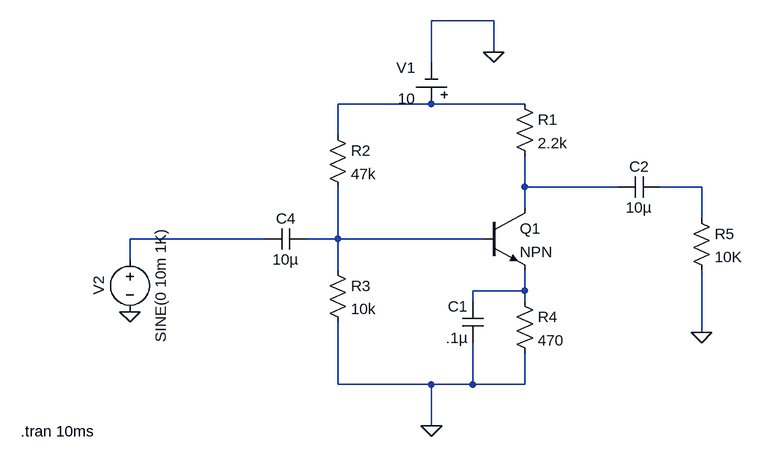
[diagram p0: schematic Amplifier Circuit.asc]
Amplifier Circuit.asc, the LTspice schematic file:
Version 4
SHEET 1 880 680
WIRE 192 -240 96 -240
WIRE 192 -192 192 -240
WIRE 96 -176 96 -240
WIRE 96 -112 -48 -112
WIRE 240 -112 96 -112
WIRE -48 -64 -48 -112
WIRE 240 16 240 -32
WIRE 384 16 240 16
WIRE 512 16 448 16
WIRE 240 48 240 16
WIRE 512 64 512 16
WIRE -160 96 -368 96
WIRE -48 96 -48 16
WIRE -48 96 -96 96
WIRE 176 96 -48 96
WIRE -368 128 -368 96
WIRE -48 144 -48 96
WIRE 240 176 240 144
WIRE 240 176 160 176
WIRE 160 192 160 176
WIRE 240 192 240 176
WIRE 512 240 512 144
WIRE -48 320 -48 224
WIRE 96 320 -48 320
WIRE 160 320 160 256
WIRE 160 320 96 320
WIRE 240 320 240 272
WIRE 240 320 160 320
WIRE 96 384 96 320
FLAG 96 384 0
FLAG 192 -192 0
FLAG -368 208 0
FLAG 512 240 0
SYMBOL res 224 -128 R0
SYMATTR InstName R1
SYMATTR Value 2.2k
SYMBOL res -64 -80 R0
SYMATTR InstName R2
SYMATTR Value 47k
SYMBOL res 224 176 R0
SYMATTR InstName R4
SYMATTR Value 470
SYMBOL res -64 128 R0
SYMATTR InstName R3
SYMATTR Value 10k
SYMBOL cap 176 256 R180
WINDOW 0 24 56 Left 2
WINDOW 3 24 8 Left 2
SYMATTR InstName C1
SYMATTR Value .1µ
SYMBOL cap -96 80 R90
WINDOW 0 0 32 VBottom 2
WINDOW 3 32 32 VTop 2
SYMATTR InstName C4
SYMATTR Value 10µ
SYMBOL Misc\\cell 96 -112 R180
WINDOW 0 24 56 Left 2
WINDOW 3 24 8 Left 2
WINDOW 123 0 0 Left 0
WINDOW 39 0 0 Left 0
SYMATTR InstName V1
SYMATTR Value 10
SYMBOL npn 176 48 R0
SYMATTR InstName Q1
SYMBOL voltage -368 112 R0
WINDOW 0 -32 56 VBottom 2
WINDOW 3 32 56 VTop 2
WINDOW 123 0 0 Left 0
WINDOW 39 0 0 Left 0
SYMATTR InstName V2
SYMATTR Value SINE(0 10m 1K)
SYMBOL cap 448 0 R90
WINDOW 0 0 32 VBottom 2
WINDOW 3 32 32 VTop 2
SYMATTR InstName C2
SYMATTR Value 10µ
SYMBOL res 496 48 R0
SYMATTR InstName R5
SYMATTR Value 10K
TEXT -536 392 Left 2 !.tran 10ms

The netlist it stands for:
* Amplifier Circuit.asc
R1 N001 N002 2.2k
R2 N001 N005 47k
R4 N006 0 470
R3 N005 0 10k
C1 0 N006 .1µ
C4 N005 N004 10µ
V1 N001 0 10
Q1 N002 N005 N006 0 NPN
V2 N004 0 SINE(0 10m 1K)
C2 N003 N002 10µ
R5 N003 0 10K
.model NPN NPN
.model PNP PNP
.lib standard.bjt
.tran 10ms
.backanno
.end